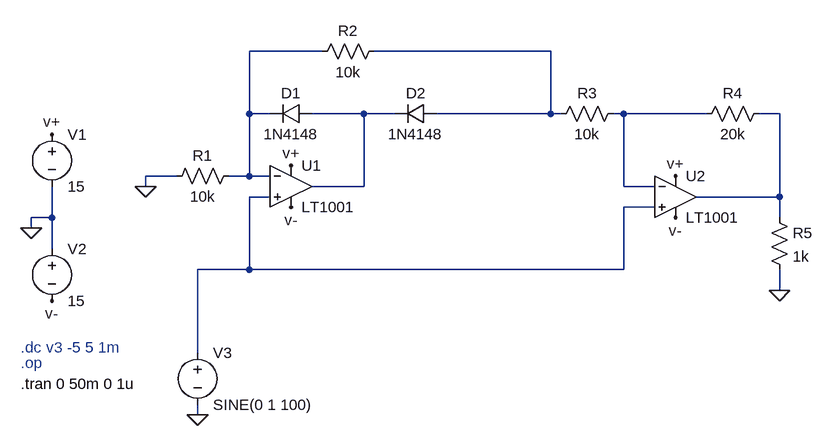
[diagram p0: schematic rectificador negativo.asc]
rectificador negativo.asc, the LTspice schematic file:
Version 4
SHEET 1 1064 680
WIRE 304 -64 192 -64
WIRE 656 -64 384 -64
WIRE 192 32 192 -64
WIRE 224 32 192 32
WIRE 368 32 288 32
WIRE 416 32 368 32
WIRE 656 32 656 -64
WIRE 656 32 480 32
WIRE 672 32 656 32
WIRE 768 32 752 32
WIRE 896 32 768 32
WIRE 1008 32 976 32
WIRE 80 128 32 128
WIRE 192 128 192 32
WIRE 192 128 160 128
WIRE 224 128 192 128
WIRE 32 144 32 128
WIRE 368 144 368 32
WIRE 368 144 288 144
WIRE 768 144 768 32
WIRE 816 144 768 144
WIRE 224 160 192 160
WIRE 1008 160 1008 32
WIRE 1008 160 880 160
WIRE 816 176 768 176
WIRE -112 192 -112 144
WIRE -112 192 -144 192
WIRE 1008 192 1008 160
WIRE -144 208 -144 192
WIRE -112 240 -112 192
WIRE 192 272 192 160
WIRE 192 272 112 272
WIRE 768 272 768 176
WIRE 768 272 192 272
WIRE 1008 304 1008 272
WIRE 112 400 112 272
WIRE 112 496 112 480
FLAG -144 208 0
FLAG -112 64 v+
FLAG -112 320 v-
FLAG 256 176 v-
FLAG 256 112 v+
FLAG 112 496 0
FLAG 848 128 v+
FLAG 848 192 v-
FLAG 32 144 0
FLAG 1008 304 0
SYMBOL OpAmps\\LT1001 256 80 R0
SYMATTR InstName U1
SYMBOL voltage -112 48 R0
WINDOW 123 0 0 Left 0
WINDOW 39 0 0 Left 0
SYMATTR InstName V1
SYMATTR Value 15
SYMBOL voltage -112 224 R0
WINDOW 123 0 0 Left 0
WINDOW 39 0 0 Left 0
SYMATTR InstName V2
SYMATTR Value 15
SYMBOL voltage 112 384 R0
WINDOW 123 0 0 Left 0
WINDOW 39 0 0 Left 0
SYMATTR InstName V3
SYMATTR Value SINE(0 1 100)
SYMBOL res 176 112 R90
WINDOW 0 0 56 VBottom 2
WINDOW 3 32 56 VTop 2
SYMATTR InstName R1
SYMATTR Value 10k
SYMBOL res 400 -80 R90
WINDOW 0 0 56 VBottom 2
WINDOW 3 32 56 VTop 2
SYMATTR InstName R2
SYMATTR Value 10k
SYMBOL diode 288 16 R90
WINDOW 0 0 32 VBottom 2
WINDOW 3 32 32 VTop 2
SYMATTR InstName D1
SYMATTR Value 1N4148
SYMBOL diode 480 16 R90
WINDOW 0 0 32 VBottom 2
WINDOW 3 32 32 VTop 2
SYMATTR InstName D2
SYMATTR Value 1N4148
SYMBOL res 768 16 R90
WINDOW 0 0 56 VBottom 2
WINDOW 3 32 56 VTop 2
SYMATTR InstName R3
SYMATTR Value 10k
SYMBOL OpAmps\\LT1001 848 96 R0
SYMATTR InstName U2
SYMBOL res 992 16 R90
WINDOW 0 0 56 VBottom 2
WINDOW 3 32 56 VTop 2
SYMATTR InstName R4
SYMATTR Value 20k
SYMBOL res 992 176 R0
SYMATTR InstName R5
SYMATTR Value 1k
TEXT -160 392 Left 2 ;.dc v3 -5 5 1m
TEXT -160 416 Left 2 ;.op
TEXT -160 448 Left 2 !.tran 0 50m 0 1u

The netlist it stands for:
* rectificador negativo.asc
XU1 N006 N001 v+ v- N003 LT1001  ; pins In+ In- V+ V- OUT
V1 v+ 0 15
V2 0 v- 15
V3 N006 0 SINE(0 1 100)
R1 N001 0 10k
R2 N002 N001 10k
D1 N003 N001 1N4148
D2 N002 N003 1N4148
R3 N004 N002 10k
XU2 N006 N004 v+ v- N005 LT1001  ; pins In+ In- V+ V- OUT
R4 N005 N004 20k
R5 N005 0 1k
.model D D
.lib standard.dio
* .dc v3 -5 5 1m
* .op
.tran 0 50m 0 1u
.lib LTC.lib
.backanno
.end